# EAGLE schematic SNES Jukebox (EAGLE 7.4.0)
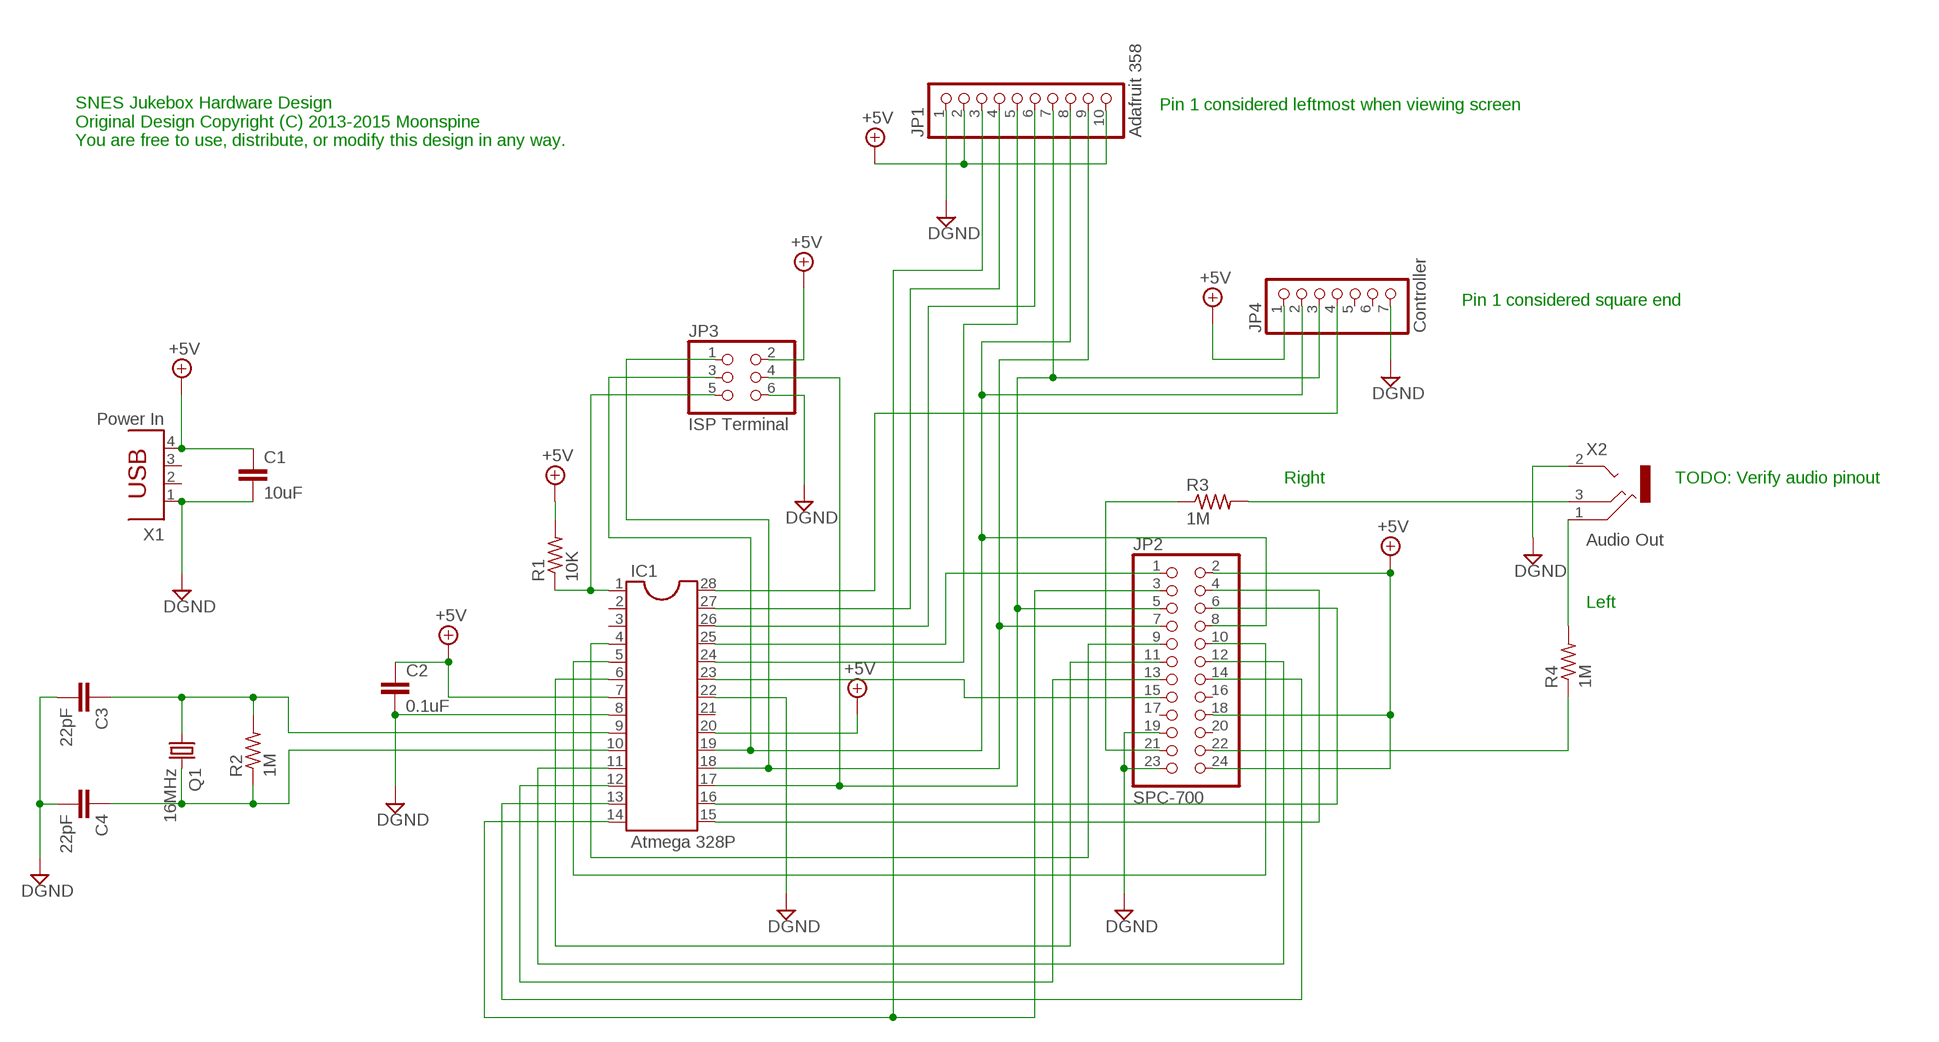
[diagram p0: schematic, sheet 1]

## Parts
C1  10uF  C-EU025-025X050  [C025-025X050]
C2  0.1uF  C-EU025-025X050  [C025-025X050]
C3  22pF  C-EU025-025X050  [C025-025X050]
C4  22pF  C-EU025-025X050  [C025-025X050]
IC1  Atmega 328P  DIL28-3  [DIL28-3]
JP1  Adafruit 358  PINHD-1X10  [1X10]
JP2  SPC-700  PINHD-2X12  [2X12]
JP3  ISP Terminal  PINHD-2X3  [2X03]
JP4  Controller  PINHD-1X7  [1X07]
Q1  16MHz  CRYSTALHC49S  [HC49/S]
R1  10K  R-US_0207/10  [0207/10]
R2  1M  R-US_0207/10  [0207/10]
R3  1M  R-US_0207/10  [0207/10]
R4  1M  R-US_0207/10  [0207/10]
X1  Power In  PN87520  [PN87520]
X2  Audio Out  1503_02  [1503_02]

## Nets
+5V: C1.1 C2.1 IC1.7 IC1.20 JP1.2 JP1.10 JP2.2 JP2.18 JP2.24 JP3.2 JP4.1 R1.2 X1.4
DGND: C1.2 C2.2 C3.2 C4.2 IC1.8 IC1.22 JP1.1 JP2.19 JP2.23 JP3.6 JP4.7 X1.1 X2.2
N$1: IC1.1 JP3.5 R1.1
N$2: JP2.22 R4.1
N$3: IC1.19 JP1.8 JP2.8 JP3.3 JP4.2
N$4: IC1.18 JP1.9 JP2.7 JP3.1
N$5: IC1.17 JP1.7 JP2.5 JP3.4 JP4.3
N$6: JP2.21 R3.1
N$7: C3.1 IC1.9 Q1.1 R2.2
N$8: C4.1 IC1.10 Q1.2 R2.1
N$9: R4.2 X2.1
N$10: R3.2 X2.3
N$12: IC1.23 JP2.15
N$13: IC1.24 JP1.5
N$14: IC1.25 JP2.1
N$15: IC1.26 JP1.6
N$16: IC1.4 JP2.9
N$17: IC1.5 JP2.10
N$18: IC1.6 JP2.11
N$19: IC1.11 JP2.12
N$20: IC1.12 JP2.13
N$21: IC1.13 JP2.14
N$22: IC1.14 JP1.3 JP2.3
N$23: IC1.15 JP2.4
N$24: IC1.16 JP2.6
N$25: IC1.27 JP1.4
N$27: IC1.28 JP4.4
Unconnected: IC1.2 IC1.3 IC1.21 JP2.16 JP2.17 JP2.20 JP4.5 JP4.6 X1.2 X1.3 X2.2@2

## Notes on the sheet
- Pin 1 considered leftmost when viewing screen
- SNES Jukebox Hardware Design
  Original Design Copyright (C) 2013-2015 Moonspine
  You are free to use, distribute, or modify this design in any way.
- Pin 1 considered square end
- Right | TODO: Verify audio pinout
- Left

## Library data of the parts
C1-C4 = resistor:C-EU: CAPACITOR, European symbol
IC1 = ic-package:DIL28: Dual In Line
JP1 = pinhead:PINHD-1X10: PIN HEADER
JP2 = pinhead:PINHD-2X12: PIN HEADER
JP3 = pinhead:PINHD-2X3: PIN HEADER
JP4 = pinhead:PINHD-1X7: PIN HEADER
Q1 = crystal:CRYSTAL: CRYSTAL; OC_FARNELL: 1667008; OC_NEWARK: unknown
R1-R4 = resistor:R-US_: RESISTOR, American symbol
X1 = con-berg:PN87520: BERG USB connector; OC_FARNELL: unknown; OC_NEWARK: unknown
X2 = con-lumberg:1503_02: Jack connectors according to JISC 6560, 3.5 mm Klinkeneinbaukupplung nach JISC 6560, 3,5 mm, 3-polig/stereo, abgewinkelte Ausführung, Surface-Mount-Technik (SMT) Source: http://www.lumberg.com/Produkte/PDFs/1503_02.pdf; OC_FARNELL: 1216979; OC_NEWARK: unknown